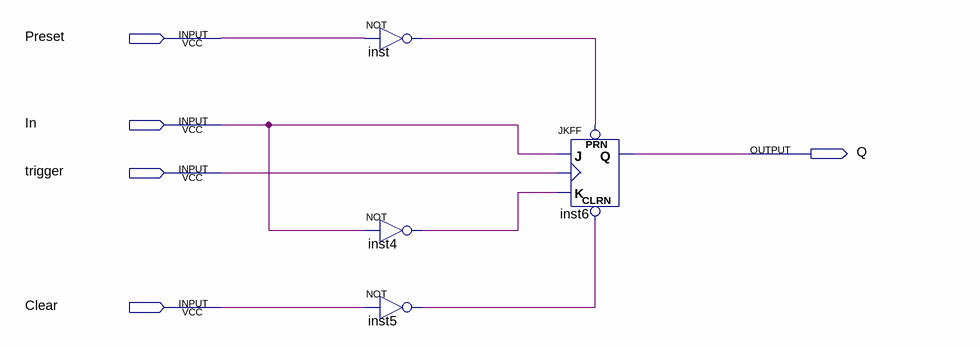
[diagram p0: schematic sheet]
// Quartus schematic flipflopjk.bdf as structural Verilog: 4 symbols, 5 pins
module flipflopjk (
  input  Preset,
  input  In,
  input  trigger,
  input  Clear,
  output Q
);

  wire inst4_out, inst5_out, inst_out;

  not inst (inst_out, Preset);
  not inst4 (inst4_out, In);
  not inst5 (inst5_out, Clear);
  JKFF inst6 (.PRN(inst_out), .CLRN(inst5_out), .K(inst4_out), .J(In), .CLK(trigger), .Q(Q));
endmodule
